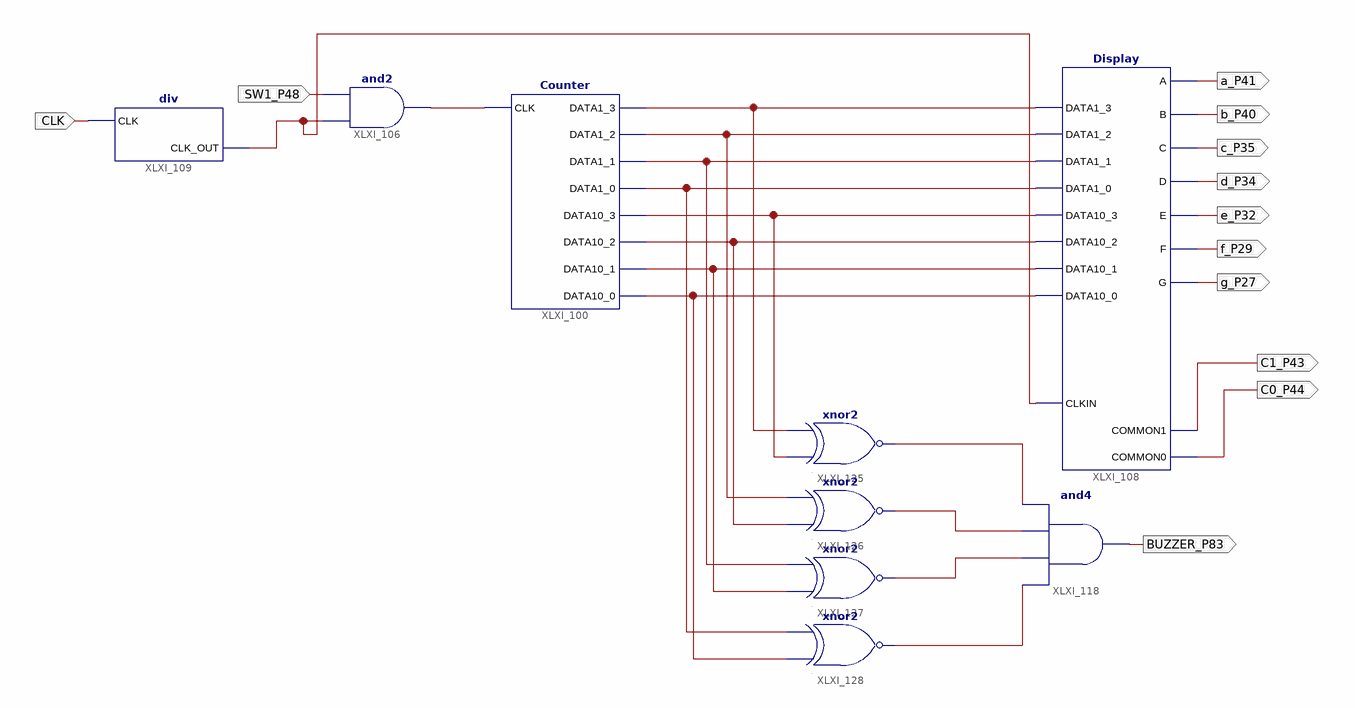
[diagram p0: schematic sheet 1]
// Xilinx ISE schematic Lab06.sch (spartan6) as structural Verilog: 9 symbols, 12 ports
module Lab06 (
  input  SW1_P48,
  input  CLK,
  output a_P41,
  output b_P40,
  output c_P35,
  output d_P34,
  output e_P32,
  output f_P29,
  output g_P27,
  output C0_P44,
  output C1_P43,
  output BUZZER_P83
);

  wire XLXN_201, XLXN_212, XLXN_245, XLXN_246, XLXN_247, XLXN_248, XLXN_249, XLXN_250, XLXN_251, XLXN_252,
       XLXN_253, XLXN_254, XLXN_255, XLXN_256;

  Counter XLXI_100 (
    .CLK(XLXN_201), .DATA1_3(XLXN_245), .DATA1_2(XLXN_247), .DATA1_1(XLXN_249), .DATA1_0(XLXN_251),
    .DATA10_3(XLXN_246), .DATA10_2(XLXN_248), .DATA10_1(XLXN_250), .DATA10_0(XLXN_252));
  and XLXI_106 (XLXN_201, XLXN_212, SW1_P48);
  div XLXI_109 (.CLK(CLK), .CLK_OUT(XLXN_212));
  Display XLXI_108 (
    .CLKIN(XLXN_212), .DATA1_0(XLXN_251), .DATA10_0(XLXN_252), .DATA1_1(XLXN_249), .DATA10_1(XLXN_250),
    .DATA1_2(XLXN_247), .DATA10_2(XLXN_248), .DATA1_3(XLXN_245), .DATA10_3(XLXN_246), .A(a_P41), .B(b_P40),
    .C(c_P35), .D(d_P34), .E(e_P32), .F(f_P29), .G(g_P27), .COMMON1(C1_P43), .COMMON0(C0_P44));
  and XLXI_118 (BUZZER_P83, XLXN_256, XLXN_255, XLXN_254, XLXN_253);
  xnor XLXI_125 (XLXN_253, XLXN_246, XLXN_245);
  xnor XLXI_126 (XLXN_254, XLXN_248, XLXN_247);
  xnor XLXI_127 (XLXN_255, XLXN_250, XLXN_249);
  xnor XLXI_128 (XLXN_256, XLXN_252, XLXN_251);
endmodule
